# EAGLE schematic stm32f103c marlin (EAGLE 9.6.2)
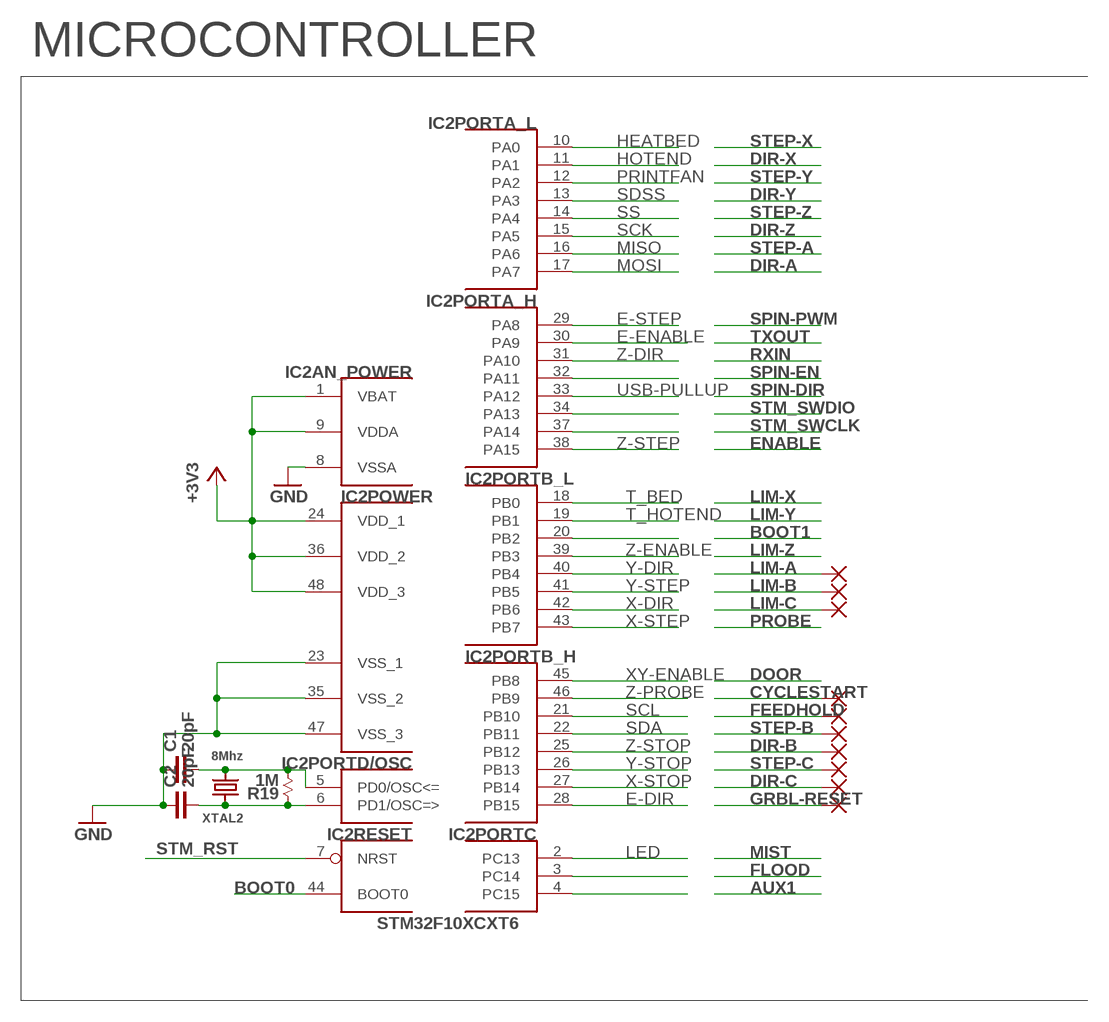
[diagram p0: schematic, sheet 1]

## Parts
C1  20pF  X893_CAP-0805  [X893_0805]
C2  20pF  X893_CAP-0805  [X893_0805]
IC2  STM32F10XCXT6  [TQFP48]
PAD6  1,6/0,8  [1,6/0,8]
PAD7  1,6/0,8  [1,6/0,8]
PAD8  1,6/0,8  [1,6/0,8]
PAD9  1,6/0,8  [1,6/0,8]
PAD10  1,6/0,8  [1,6/0,8]
PAD11  1,6/0,8  [1,6/0,8]
PAD12  1,6/0,8  [1,6/0,8]
PAD13  1,6/0,8  [1,6/0,8]
PAD14  1,6/0,8  [1,6/0,8]
PAD15  1,6/0,8  [1,6/0,8]
R19  1M  X893_RESISTOR-0805  [X893_0805]
XTAL2  8Mhz  CRYSTALTHIN  [CRYSTAL_3.2X2.5]

## Nets
+3V3: IC2.1(AN_POWER:VBAT) IC2.9(AN_POWER:VDDA) IC2.24(POWER:VDD_1) IC2.36(POWER:VDD_2) IC2.48(POWER:VDD_3)
BOOT0: IC2.44(RESET:BOOT0)
CYCLESTART: PAD12.1(P)
DIR-B: PAD9.1(P)
DIR-C: PAD7.1(P)
E-DIR: IC2.28(PORTB_H:PB15)
E-ENABLE: IC2.30(PORTA_H:PA9)
E-STEP: IC2.29(PORTA_H:PA8)
FEEDHOLD: PAD11.1(P)
GND: C1.2 C2.2 IC2.8(AN_POWER:VSSA) IC2.23(POWER:VSS_1) IC2.35(POWER:VSS_2) IC2.47(POWER:VSS_3)
GRBL-RESET: PAD6.1(P)
HEATBED: IC2.10(PORTA_L:PA0)
HOTEND: IC2.11(PORTA_L:PA1)
LED: IC2.2(PORTC:PC13)
LIM-A: PAD15.1(P)
LIM-B: PAD14.1(P)
LIM-C: PAD13.1(P)
MISO: IC2.16(PORTA_L:PA6)
MOSI: IC2.17(PORTA_L:PA7)
N$5: C1.1 IC2.5(PORTD/OSC:PD0/OSC<=) R19.2 XTAL2.2
N$10: IC2.34(PORTA_H:PA13)
N$13: IC2.32(PORTA_H:PA11)
N$16: IC2.37(PORTA_H:PA14)
N$20: IC2.20(PORTB_L:PB2)
N$26: C2.1 IC2.6(PORTD/OSC:PD1/OSC=>) R19.1 XTAL2.1
N$36: IC2.3(PORTC:PC14)
N$37: IC2.4(PORTC:PC15)
PRINTFAN: IC2.12(PORTA_L:PA2)
SCK: IC2.15(PORTA_L:PA5)
SCL: IC2.21(PORTB_H:PB10)
SDA: IC2.22(PORTB_H:PB11)
SDSS: IC2.13(PORTA_L:PA3)
SS: IC2.14(PORTA_L:PA4)
STEP-B: PAD10.1(P)
STEP-C: PAD8.1(P)
STM_RST: IC2.7(RESET:NRST)
T_BED: IC2.18(PORTB_L:PB0)
T_HOTEND: IC2.19(PORTB_L:PB1)
USB-PULLUP: IC2.33(PORTA_H:PA12)
X-DIR: IC2.42(PORTB_L:PB6)
X-STEP: IC2.43(PORTB_L:PB7)
X-STOP: IC2.27(PORTB_H:PB14)
XY-ENABLE: IC2.45(PORTB_H:PB8)
Y-DIR: IC2.40(PORTB_L:PB4)
Y-STEP: IC2.41(PORTB_L:PB5)
Y-STOP: IC2.26(PORTB_H:PB13)
Z-DIR: IC2.31(PORTA_H:PA10)
Z-ENABLE: IC2.39(PORTB_L:PB3)
Z-PROBE: IC2.46(PORTB_H:PB9)
Z-STEP: IC2.38(PORTA_H:PA15)
Z-STOP: IC2.25(PORTB_H:PB12)

## Notes on the sheet
- MICROCONTROLLER

## Library data of the parts
C1 C2 = maple-10x-20x:X893_CAP: Capacitor
IC2 = stm32:STM32F10XCXT6: ST STM32F101/103 48pin LQFP
PAD6-PAD15 = wirepad:1,6/0,8: THROUGH-HOLE PAD
R19 = maple-10x-20x:X893_RESISTOR
XTAL2 = microbuilder:CRYSTAL: Crystals HC49UP - Surface Mount Crystal 4.0MHz 18pF +/-30ppm Surface Mount Crystal [Digikey: 535-9857-1-ND] 12.0 MHz Surface Mount Crystal [Digikey: 535-9869-6-ND] 25.0 MHz Surface Mount Crystal [Digikey: 535-9078-1-ND] 3.2 x 2.5mm - MEMs SMT Crystal 12.0 MHz 8pF 15ppm 3.2 x 2.5mm Crystal [Digikey: -10-70°C: 644-1047-1-ND -40-125°C: 644-1128-1-ND] 16.0 MHz 8pF 15ppm 3.2 x 2.5mm Crystal [Digikey: -10-70°C: 644-1049-1-ND -40-125°C: 644-1129-2-ND] 16.0 MHz 10pF 10ppm 3.2 x 2.5mm Crystal [Digikey: 644-1100-1-ND] 27.12 MHz 18pF 30ppm 3.2 x 2.5mm Crystal [Digikey: 887-1424-1-ND] 27.12MHz 10pF 10ppm 3.2 x 2.5mm Crystal [Digikey: 887-1329-1-ND] 4.9 x 1.8mm - MEMs SMT Crystal 32.768 KHz 12.5pF 20ppm 4.9 x 1.8mm Crystal [Digikey: SE2415CT-ND] Cylinder 32.768KHz Cylinder Crystal

## Net classes
0 default: width 0.203 mm, clearance 0.152 mm